# EAGLE design Power Supply (EAGLE 6.2)
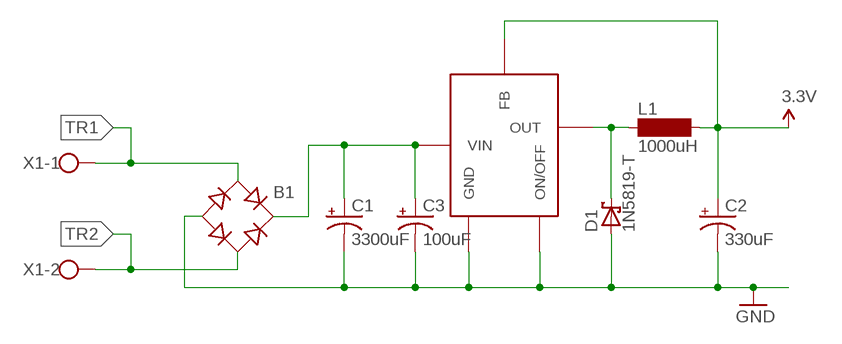
[diagram p0: schematic, sheet 1]

## Parts
B1  DBDB101G  [DB]
C1  3300uF  CPOL-USE7.5-18  [E7,5-18]
C2  330uF  CPOL-USE5-8.5  [E5-8,5]
C3  100uF  CPOL-USE5-8.5  [E5-8,5]
D1  1N5819-T  [DO41-7.6]
L1  1000uH  BS11  [BS11]
U$1  LM2575  [LINEAR-TECHNOLOGY_TO220-5]
X1  W237-102  [W237-102]

## Nets
3.3V: C2.+ L1.2 U$1.FB
GND: B1.- C1.- C2.- C3.- D1.A U$1.GND U$1.ON/OFF
N$1: D1.C L1.1 U$1.OUT
N$3: B1.+ C1.+ C3.+ U$1.VIN
TR1: B1.AC1 X1.1
TR2: B1.AC2 X1.2

## Library data of the parts
B1 = rectifier:DB?*G: Single Phase 1.0 AMP Glass Passivated Bridge Rectifier Taiwan Semiconductor Co.,Ltd. - TSC Source: http://www.taiwansemi.com/TSCbig5/ezcatfiles/cust/img/img/db101g.pdf http://www.ts.com.tw/db/pictures/modules/PDT/PDT060207001/DBLS201G.pdf
C1-C3 = adafruit:CPOL-US: POLARIZED CAPACITOR, American symbol
D1 = diode:1N581*: 1.0A SCHOTTKY BARRIER RECTIFIER Source: http://www.diodes.com/datasheets/ds23001.pdf
L1 = inductor-neosid:BS: INDUCTOR nominal inductance, magnetically screened; OC_FARNELL: unknown; OC_NEWARK: unknown
U$1 = LM2575:LM2575
X1 = con-wago-500:W237-102: WAGO SCREW CLAMP; MPN: 237-102; OC_FARNELL: unknown; OC_NEWARK: 70K9898

## Net classes
0 default: clearance 0.305 mm

## Board
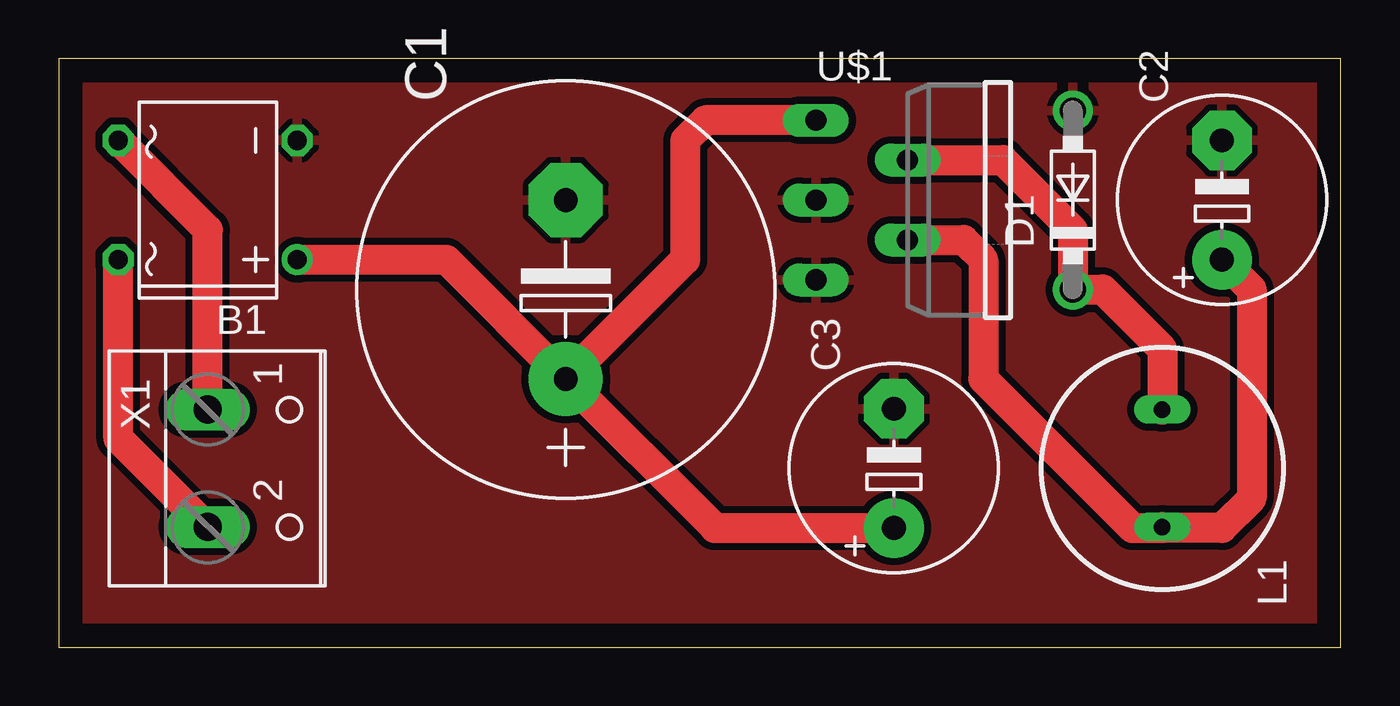
[diagram p1: board, top side]
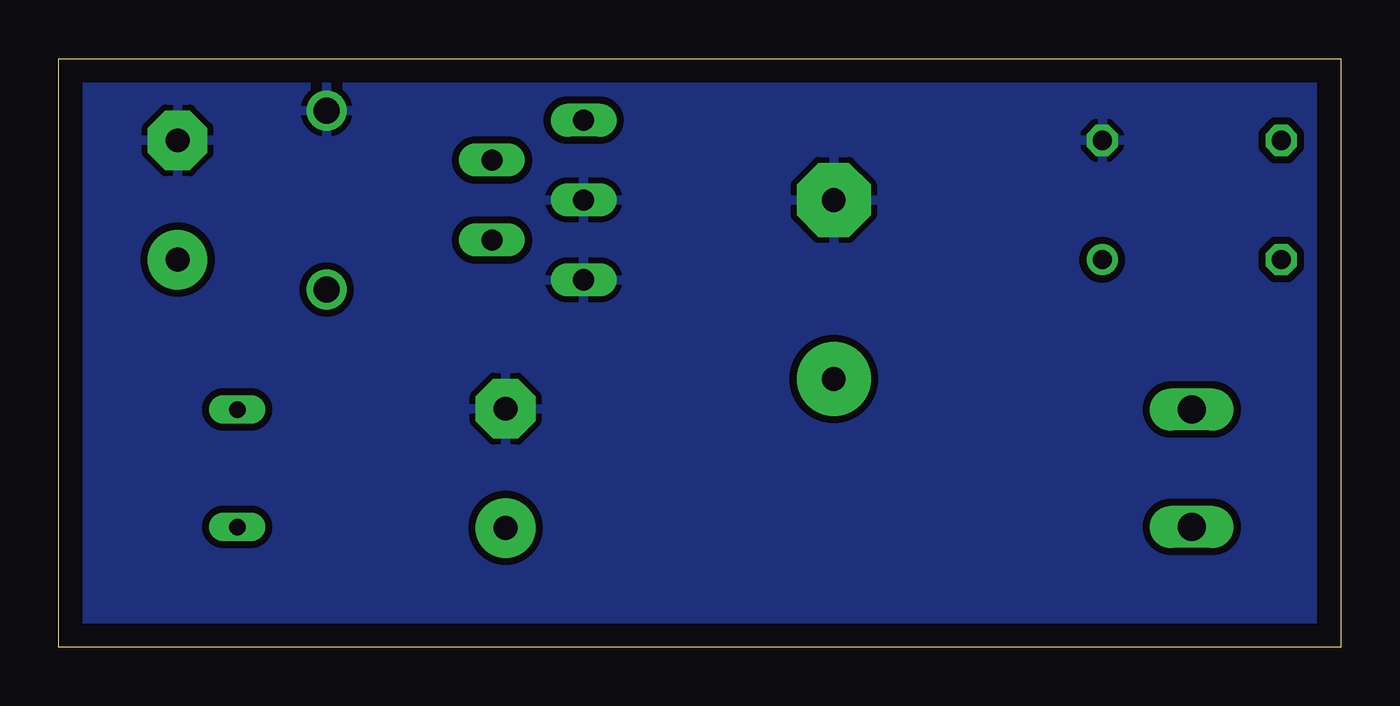
[diagram p2: board, bottom side, seen from below]

Size 54.59 x 25.07 mm. Coordinates in mm from the lower left corner, seen from the top.
Outline: 0,0 54.59,0 54.59,25.07 0,25.07 0,0
Copper layers (1*16): Top 0.035mm / dielectric 1.5mm / Bottom 0.035mm
Design rules: minimum track width 10mil, minimum drill 24mil, track to track 8mil, track to pad 8mil, pad to pad 8mil, via to via 8mil, smd to smd 8mil, copper to edge 40mil, drill to drill 8mil, minimum pad ring 10mil, minimum via ring 8mil, stop-mask expansion 4mil, vias tented up to drill 0mil, thermal gap 10mil

### Footprints (pad centres in the part's own frame; a part is rotated, then mirrored left to right if it is on the bottom)
DB = drill 0.813: + -2.54,-3.81 | drill 0.813 octagon: - 2.54,-3.81; AC1 2.54,3.81; AC2 -2.54,3.81
E7,5-18 = drill 1.016 pad 3.15: + -3.81,0 | drill 1.016 pad 3.15 octagon: - 3.81,0
E5-8,5 = drill 1.016 pad 2.54: + -2.54,0 | drill 1.016 pad 2.54 octagon: - 2.54,0
DO41-7.6 = drill 1.1 pad 1.7: A 3.81,0; C -3.81,0
BS11 = drill 0.7 long: 1 -2.5,0; 2 2.5,0
LINEAR-TECHNOLOGY_TO220-5 = drill 0.9 long: FB 1.7,-4.5; GND 0,-8.4; ON/OFF 3.4,-8.4; OUT -1.7,-4.5; VIN -3.4,-8.4
W237-102 = drill 1.194 long: 1 -2.5,-1.27; 2 2.5,-1.27

### Placement (x,y rotation side)
B1  6.35,19.05 90 top
C1  21.59,15.24 90 top
C2  49.53,19.05 90 top
C3  35.56,7.62 90 top
D1  43.18,19.05 90 top
L1  46.99,7.62 270 top
U$1  40.64,19.05 270 top
X1  7.62,7.62 270 top

### Tracks (layer width: path | path; a pad name or v marks a point on that pad's centre or on a via)
3.3V
  Top 1.27: U$1.FB 38.53,17.35 39.37,16.51 39.37,11.43 45.72,5.08 46.95,5.08 L1.2 47.03,5.08 49.53,5.08 50.8,6.35 50.8,15.24 C2.+
GND
  pour Bottom: -1.27,27.94 62.23,27.94 62.23,-1.27 -1.27,-1.27
  pour Top: -1.27,27.94 55.88,27.94 55.88,-1.27 -1.27,-1.27
N$1
  Top 1.27: U$1.OUT 40.21,20.75 43.18,17.78 D1.C 44.45,15.24 46.99,12.7 L1.1
N$3
  Top 1.27: B1.+ 16.51,16.51 C1.+ | C1.+ 27.94,5.08 C3.+ | C1.+ 26.67,16.51 26.67,21.59 27.53,22.45 U$1.VIN
TR1
  Top 1.27: X1.1 6.35,17.78 B1.AC1
TR2
  Top 1.27: X1.2 6.31,5.12 2.54,8.89 B1.AC2